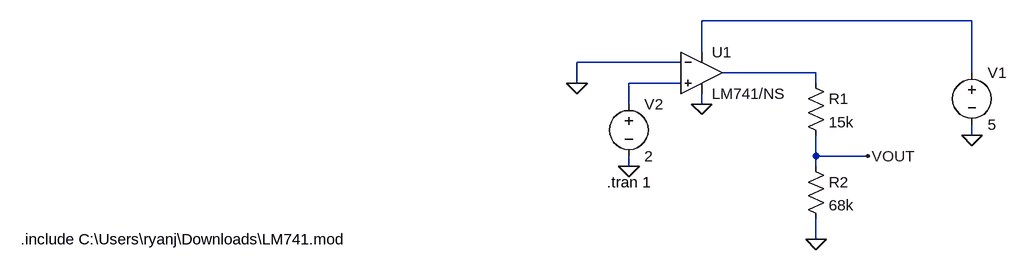
[diagram p0: schematic Colour 3V3 Output.asc]
Colour 3V3 Output.asc, the LTspice schematic file:
Version 4
SHEET 1 880 680
WIRE 560 32 144 32
WIRE 144 80 144 32
WIRE 112 96 -48 96
WIRE 320 112 176 112
WIRE 560 112 560 32
WIRE -48 128 -48 96
WIRE 112 128 32 128
WIRE 320 128 320 112
WIRE 32 160 32 128
WIRE 144 160 144 144
WIRE 560 208 560 192
WIRE 320 240 320 208
WIRE 400 240 320 240
WIRE 32 256 32 240
WIRE 320 256 320 240
WIRE 320 368 320 336
FLAG 560 208 0
FLAG 32 256 0
FLAG 144 160 0
FLAG -48 128 0
FLAG 320 368 0
FLAG 400 240 VOUT
SYMBOL voltage 560 96 R0
WINDOW 123 0 0 Left 0
WINDOW 39 0 0 Left 0
SYMATTR InstName V1
SYMATTR Value 5
SYMBOL voltage 32 144 R0
WINDOW 123 0 0 Left 0
WINDOW 39 0 0 Left 0
SYMATTR InstName V2
SYMATTR Value 2
SYMBOL OpAmps\\opamp2 144 48 R0
SYMATTR InstName U1
SYMATTR Value LM741/NS
SYMBOL res 304 112 R0
SYMATTR InstName R1
SYMATTR Value 15k
SYMBOL res 304 240 R0
SYMATTR InstName R2
SYMATTR Value 68k
TEXT -2 280 Left 2 !.tran 1
TEXT -904 368 Left 2 !.include C:\\Users\\ryanj\\Downloads\\LM741.mod

The netlist it stands for:
* Colour 3V3 Output.asc
V1 N001 0 5
V2 N003 0 2
XU1 N003 0 N001 0 N002 LM741/NS  ; pins In+ In- V+ V- OUT
R1 N002 VOUT 15k
R2 VOUT 0 68k
.tran 1
.include C:\Users\ryanj\Downloads\LM741.mod
.backanno
.end